# Altium schematic sheet Encoder Fin ARM - System.SchDoc
size B
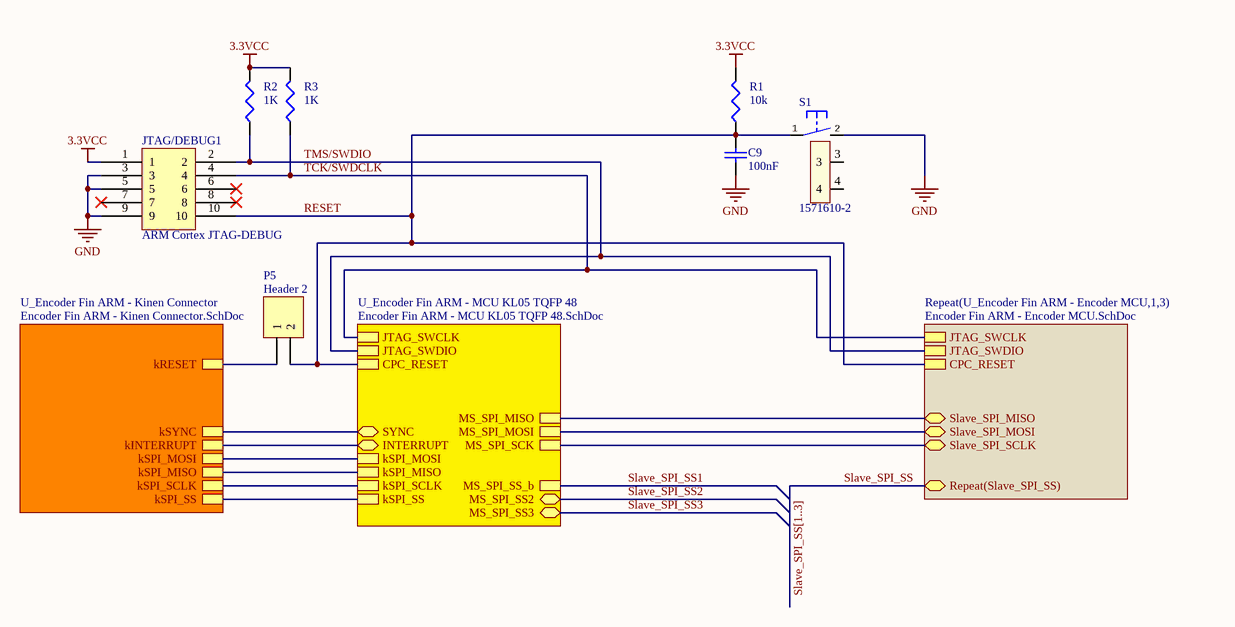
[diagram p0: Encoder Fin ARM - System.SchDoc]

## Parts
C9  value 100nF  [1608[0603]]  (hidden comment: Cap Semi)
JTAG/DEBUG1  ARM Cortex JTAG-DEBUG  [FTSH-105-XX-X-DV]
P5  Header 2  [HDR1X2]
R1  value 10k  [J1-0603]  (hidden comment: Res3)
R2  value 1K  [J1-0603]  (hidden comment: Res3)
R3  value 1K  [J1-0603]  (hidden comment: Res3)
S1  1571610-2  [B3F-31XX]

## Sub-sheets
Repeat(U_Encoder Fin ARM - Encoder MCU,1,3) = Encoder Fin ARM - Encoder MCU.SchDoc: JTAG_SWCLK, JTAG_SWDIO, CPC_RESET, Slave_SPI_MOSI, Slave_SPI_MISO, Slave_SPI_SCLK, Repeat(Slave_SPI_SS)
U_Encoder Fin ARM - Kinen Connector = Encoder Fin ARM - Kinen Connector.SchDoc: kSPI_MOSI, kSPI_MISO, kSPI_SCLK, kSPI_SS, kRESET, kINTERRUPT, kSYNC
U_Encoder Fin ARM - MCU KL05 TQFP 48 = Encoder Fin ARM - MCU KL05 TQFP 48.SchDoc: JTAG_SWCLK, JTAG_SWDIO, CPC_RESET, kSPI_MOSI, kSPI_MISO, kSPI_SCLK, kSPI_SS, MS_SPI_MISO, MS_SPI_SS_b, MS_SPI_MOSI, MS_SPI_SCK, MS_SPI_SS2, MS_SPI_SS3, INTERRUPT, SYNC

## Nets
3.3VCC: JTAG/DEBUG1.1 R1.2 R2.2 R3.2
GND: C9.1 JTAG/DEBUG1.3 JTAG/DEBUG1.5 JTAG/DEBUG1.9 S1.2(S)
RESET: C9.2 JTAG/DEBUG1.10 P5.2 R1.1 S1.1(P) ; sheet Repeat(U_Encoder Fin ARM - Encoder MCU,1,3)/CPC_RESET, sheet U_Encoder Fin ARM - MCU KL05 TQFP 48/CPC_RESET
Slave_SPI_SS: sheet Repeat(U_Encoder Fin ARM - Encoder MCU,1,3)/Repeat(Slave_SPI_SS)
Slave_SPI_SS1: sheet U_Encoder Fin ARM - MCU KL05 TQFP 48/MS_SPI_SS_b
Slave_SPI_SS2: sheet U_Encoder Fin ARM - MCU KL05 TQFP 48/MS_SPI_SS2
Slave_SPI_SS3: sheet U_Encoder Fin ARM - MCU KL05 TQFP 48/MS_SPI_SS3
TCK/SWDCLK: JTAG/DEBUG1.4 R3.1 ; sheet Repeat(U_Encoder Fin ARM - Encoder MCU,1,3)/JTAG_SWCLK, sheet U_Encoder Fin ARM - MCU KL05 TQFP 48/JTAG_SWCLK
TMS/SWDIO: JTAG/DEBUG1.2 R2.1 ; sheet Repeat(U_Encoder Fin ARM - Encoder MCU,1,3)/JTAG_SWDIO, sheet U_Encoder Fin ARM - MCU KL05 TQFP 48/JTAG_SWDIO
NetP5_1: P5.1 ; sheet U_Encoder Fin ARM - Kinen Connector/kRESET
(unnamed): sheet Repeat(U_Encoder Fin ARM - Encoder MCU,1,3)/Slave_SPI_MOSI, sheet U_Encoder Fin ARM - MCU KL05 TQFP 48/MS_SPI_MOSI
(unnamed): sheet Repeat(U_Encoder Fin ARM - Encoder MCU,1,3)/Slave_SPI_MISO, sheet U_Encoder Fin ARM - MCU KL05 TQFP 48/MS_SPI_MISO
(unnamed): sheet Repeat(U_Encoder Fin ARM - Encoder MCU,1,3)/Slave_SPI_SCLK, sheet U_Encoder Fin ARM - MCU KL05 TQFP 48/MS_SPI_SCK
(unnamed): sheet U_Encoder Fin ARM - MCU KL05 TQFP 48/kSPI_MOSI, sheet U_Encoder Fin ARM - Kinen Connector/kSPI_MOSI
(unnamed): sheet U_Encoder Fin ARM - MCU KL05 TQFP 48/kSPI_MISO, sheet U_Encoder Fin ARM - Kinen Connector/kSPI_MISO
(unnamed): sheet U_Encoder Fin ARM - MCU KL05 TQFP 48/kSPI_SCLK, sheet U_Encoder Fin ARM - Kinen Connector/kSPI_SCLK
(unnamed): sheet U_Encoder Fin ARM - MCU KL05 TQFP 48/kSPI_SS, sheet U_Encoder Fin ARM - Kinen Connector/kSPI_SS
(unnamed): sheet U_Encoder Fin ARM - MCU KL05 TQFP 48/INTERRUPT, sheet U_Encoder Fin ARM - Kinen Connector/kINTERRUPT
(unnamed): sheet U_Encoder Fin ARM - MCU KL05 TQFP 48/SYNC, sheet U_Encoder Fin ARM - Kinen Connector/kSYNC

Not connected (* = marked no-connect by the designer): JTAG/DEBUG1 6* 7* 8*; S1 3 4

## Buses and harness runs
bus Slave_SPI_SS[1..3]

## Library data of the parts
C9 = Cap Semi: Capacitor (Semiconductor SIM Model); Published: 8-Jun-2000; LatestRevisionDate: 29-May-2009; LatestRevisionNote: IPC-7351 Footprint Added.; PackageReference: C1206; Publisher: Altium Limited; PackageDescription: Chip Capacitor
JTAG/DEBUG1 = ARM Cortex JTAG-DEBUG Header
P5 = Header 2: Header, 2-Pin; LatestRevisionDate: 17-Jul-2002; LatestRevisionNote: Re-released for DXP Platform.; Publisher: Altium Limited
R1-R3 = Res3: Resistor; Published: 8-Jun-2000; LatestRevisionDate: 29-May-2009; LatestRevisionNote: IPC-7351 Footprint Added.; PackageReference: J1-0603; Publisher: Altium Limited; PackageDescription: Chip Resistor
S1 = 1571610-2_1: SWTCH Momentary Washable; Manufacturer: Omron; Manufacturer: TE; LastRevisionNote: Import; ComponentLink1URL: http://www.te.com/commerce/DocumentDelivery/DDEController?Action=srchrtrv&DocNm=1571610&DocType=Customer+Drawing&DocLang=English; ComponentLink1Description: Datasheet for B3F-31XX; Published: 23-Apr-2014; Publisher: UltiMachine; LastRevisionDate: 23-Apr-2014; ManufacturerPartNumber: 1571610-2; Supplier 1: Mouser; Supplier Part Number 1: 506-1571610-2